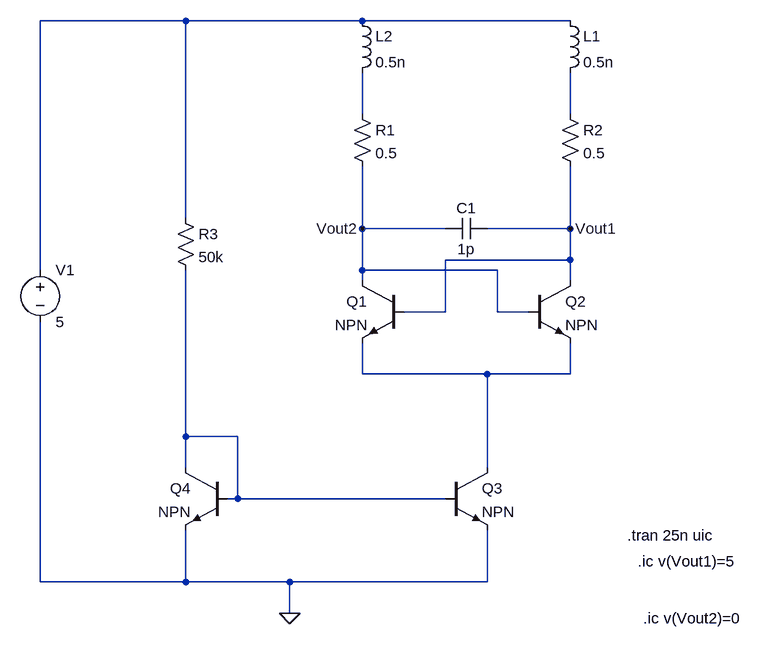
[diagram p0: schematic PART2.asc]
PART2.asc, the LTspice schematic file:
Version 4
SHEET 1 880 840
WIRE -192 -96 -416 -96
WIRE 80 -96 -192 -96
WIRE 400 -96 80 -96
WIRE 80 48 80 -16
WIRE 400 48 400 -16
WIRE -192 208 -192 -96
WIRE 80 224 80 128
WIRE 208 224 80 224
WIRE 400 224 400 128
WIRE 400 224 272 224
WIRE 400 272 400 224
WIRE 400 272 208 272
WIRE -416 288 -416 -96
WIRE 80 288 80 224
WIRE 288 288 80 288
WIRE 80 304 80 288
WIRE 400 304 400 272
WIRE 208 352 208 272
WIRE 208 352 144 352
WIRE 288 352 288 288
WIRE 336 352 288 352
WIRE 80 448 80 400
WIRE 272 448 80 448
WIRE 400 448 400 400
WIRE 400 448 272 448
WIRE -192 544 -192 288
WIRE -112 544 -192 544
WIRE -192 592 -192 544
WIRE 272 592 272 448
WIRE -112 640 -112 544
WIRE -112 640 -128 640
WIRE 208 640 -112 640
WIRE -416 768 -416 368
WIRE -192 768 -192 688
WIRE -192 768 -416 768
WIRE -32 768 -192 768
WIRE 272 768 272 688
WIRE 272 768 -32 768
WIRE -32 816 -32 768
FLAG -32 816 0
FLAG 400 224 Vout1
FLAG 80 224 Vout2
SYMBOL ind 384 -112 R0
SYMATTR InstName L1
SYMATTR Value 0.5n
SYMBOL ind 64 -112 R0
SYMATTR InstName L2
SYMATTR Value 0.5n
SYMBOL cap 272 208 R90
WINDOW 0 0 32 VBottom 2
WINDOW 3 32 32 VTop 2
SYMATTR InstName C1
SYMATTR Value 1p
SYMBOL npn 336 304 R0
SYMATTR InstName Q2
SYMBOL npn 144 304 M0
SYMATTR InstName Q1
SYMBOL npn 208 592 R0
SYMATTR InstName Q3
SYMBOL npn -128 592 M0
SYMATTR InstName Q4
SYMBOL voltage -416 272 R0
WINDOW 123 0 0 Left 0
WINDOW 39 0 0 Left 0
SYMATTR InstName V1
SYMATTR Value 5
SYMBOL res 64 32 R0
SYMATTR InstName R1
SYMATTR Value 0.5
SYMBOL res 384 32 R0
SYMATTR InstName R2
SYMATTR Value 0.5
SYMBOL res -208 192 R0
SYMATTR InstName R3
SYMATTR Value 50k
TEXT 488 696 Left 2 !.tran 25n uic
TEXT 504 736 Left 2 !.ic v(Vout1)=5
TEXT 512 824 Left 2 !.ic v(Vout2)=0

The netlist it stands for:
* PART2.asc
L1 N001 N003 0.5n
L2 N001 N002 0.5n
C1 Vout1 Vout2 1p
Q2 Vout1 Vout2 N004 0 NPN
Q1 Vout2 Vout1 N004 0 NPN
Q3 N004 N005 0 0 NPN
Q4 N005 N005 0 0 NPN
V1 N001 0 5
R1 N002 Vout2 0.5
R2 N003 Vout1 0.5
R3 N001 N005 50k
.model NPN NPN
.model PNP PNP
.lib standard.bjt
.tran 25n uic
.ic v(Vout1)=5
.ic v(Vout2)=0
.backanno
.end